# EAGLE design SwitchingUnit (EAGLE 9.3.1)
CNAME: YISC Entry - Device Unit; CREVISION: Prototype; DESIGNER: Matthew Charlston
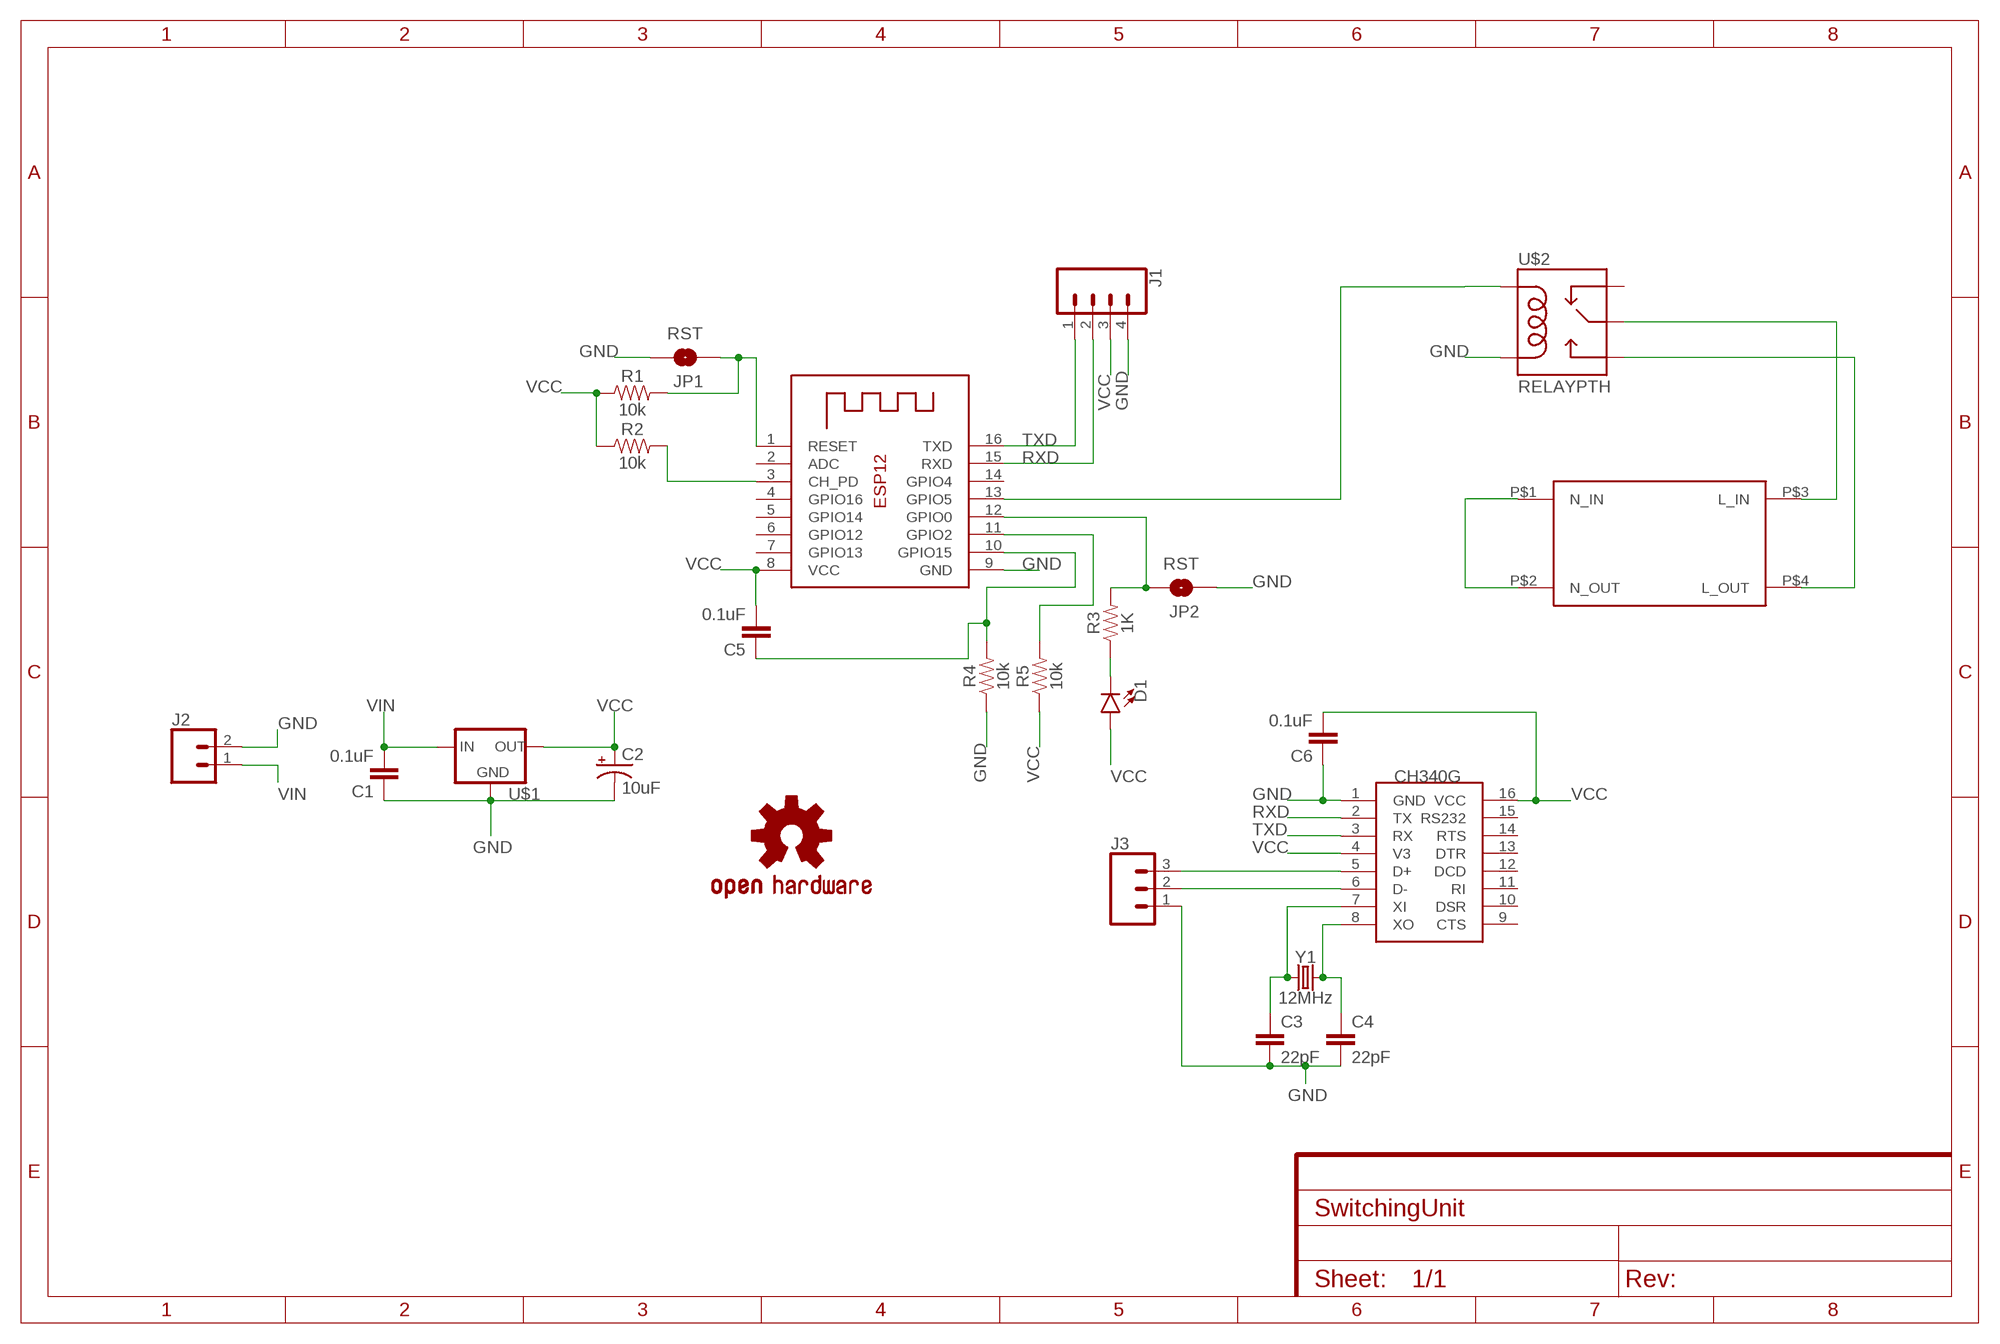
[diagram p0: schematic, sheet 1]

## Parts
C1  0.1uF  0.1UF-KIT-EZ-50V-20%  [CAP-PTH-SMALL-KIT]
C2  10uF  10UF-POLAR-RADIAL-2.5MM-25V-20%  [CPOL-RADIAL-2.5MM-5MM]
C3  22pF  22PF-PTH-2.54MM-200V-5%  [CAP-PTH-2.54]
C4  22pF  22PF-PTH-2.54MM-200V-5%  [CAP-PTH-2.54]
C5  0.1uF  0.1UF-KIT-EZ-50V-20%  [CAP-PTH-SMALL-KIT]
C6  0.1uF  0.1UF-KIT-EZ-50V-20%  [CAP-PTH-SMALL-KIT]
D1  LED5MM  [LED_5MM]
J1  CONN_04  [1X04]
J2  CONN_02  [1X02]
J3  CONN_03  [1X03]
JP1  RST  JUMPER-SMT_2_NO_SILK_ROUND  [SMT-JUMPER_2_NO_SILK_ROUND]
JP2  RST  JUMPER-SMT_2_NO_SILK_ROUND  [SMT-JUMPER_2_NO_SILK_ROUND]
LOGO1  OSHW-LOGOL  [OSHW-LOGO-L]
R1  10k  10KOHM-HORIZ-1/4W-1%  [AXIAL-0.3]
R2  10k  10KOHM-HORIZ-1/4W-1%  [AXIAL-0.3]
R3  1K  10KOHM-HORIZ-1/4W-1%  [AXIAL-0.3]
R4  10k  10KOHM-HORIZ-1/4W-1%  [AXIAL-0.3]
R5  10k  10KOHM-HORIZ-1/4W-1%  [AXIAL-0.3]
U$1  V_REG_LD1117VXX  [78XXL]
U$2  RELAYPTH  [SRD-05VDC-SL-C]
U$3  MC_MAINS  [MC_MAINS_NEW]
U$4  CH340G  [SOIC16]
X1  ESP-12  [ESP-12]
Y1  12MHz  CRYSTAL-16MHZPTH-HC49US  [HC49US]

## Nets
GND: C1.1 C2.2(-) C3.2 C4.2 C6.1 J1.4 J2.2 J3.1 JP1.2 JP2.1 R4.P$1 U$1.IN(GND) U$2.COIL0 U$4.1(GND) X1.9(GND)
N$1: C3.1 U$4.7(XI) Y1.1
N$2: C4.1 U$4.8(XO) Y1.2
N$3: JP1.1 R1.P$2 X1.1(RESET)
N$4: R2.P$2 X1.3(CH_PD)
N$5: JP2.2 R3.P$2 X1.12(GPIO0)
N$6: D1.K(C) R3.P$1
N$7: C5.1 R4.P$2 X1.10(GPIO15)
N$8: R5.P$2 X1.11(GPIO2)
N$9: U$3.P$1(N_IN) U$3.P$2(N_OUT)
N$10: U$2.COIL1 X1.13(GPIO5)
N$11: U$2.SWCOMMON U$3.P$3(L_IN)
N$12: U$2.SWOPEN U$3.P$4(L_OUT)
N$13: J3.3 U$4.5(D+)
N$14: J3.2 U$4.6(D-)
RXD: J1.2 U$4.2(TX) X1.15(RXD)
TXD: J1.1 U$4.3(RX) X1.16(TXD)
VCC: C2.1(+) C5.2 C6.2 D1.A J1.3 R1.P$1 R2.P$1 R5.P$1 U$1.GND(OUT) U$4.4(V3) U$4.16(VCC) X1.8(VCC)
VIN: C1.2 J2.1 U$1.OUT(IN)
Unconnected: U$2.SWCLOSED(SWCLOSE) U$4.9(CTS) U$4.10(DSR) U$4.11(RI) U$4.12(DCD) U$4.13(DTR) U$4.14(RTS) U$4.15(RS232) X1.2(ADC) X1.4(GPIO16) X1.5(GPIO14) X1.6(GPIO12) X1.7(GPIO13) X1.14(GPIO4)

## Library data of the parts
C1 C5 C6 = SparkFun-Capacitors:0.1UF: 0.1µF ceramic capacitors A capacitor is a passive two-terminal electrical component used to store electrical energy temporarily in an electric field.; PROD_ID: CAP-08370
C2 = SparkFun-Capacitors:10UF-POLAR: 10.0µF polarized capacitors A capacitor is a passive two-terminal electrical component used to store electrical energy temporarily in an electric field.; PROD_ID: CAP-08440
C3 C4 = SparkFun-Capacitors:22PF: 22pF ceramic capacitors A capacitor is a passive two-terminal electrical component used to store electrical energy temporarily in an electric field.; PROD_ID: CAP-09128
D1 = SparkFun-LED:LED: LED (Generic) Standard schematic elements and footprints for 5mm, 3mm, 1206, and 0603 sized LEDs. Generic LEDs with no color specified.
J1 = SparkFun-Connectors:CONN_04: Multi connection point. Often used as Generic Header-pin footprint for 0.1 inch spaced/style header connections On any of the 0.1 inch spaced packages, you can populate with these: Break Away Headers - Straight <https://www.sparkfun.com/products/116> (PRT-00116) Break Away Male Headers - Right Angle <https://www.sparkfun.com/products/553> (PRT-00553) Female Headers <https://www.sparkfun.com/products/115> (PRT-00115) Break Away Headers - Machine Pin <https://www.sparkfun.com/products/117> (PRT-00117) Break Away Female Headers - Swiss Machine Pin <https://www.sparkfun.com/products/743> (PRT-00743) For SCREWTERMINALS and SPRING TERMINALS visit here: Screw Terimnals on SparkFun.com <https://www.sparkfun.com/search/results?term=Screw+Terminals> (5mm/3.5mm/2.54mm spacing) This device is also useful as a general connection point to wire up your design to another part of your project. Our various solder wires solder well into these plated through hole pads. Hook-Up Wire - Assortment (Stranded, 22 AWG) <https://www.sparkfun.com/products/11375> (PRT-11375) Hook-Up Wire - Assortment (Solid Core, 22 AWG) <https://www.sparkfun.com/products/11367> (PRT-11367) View the entire wire category on our website here <https://www.sparkfun.com/categories/141> Special notes: Molex polarized connector foot print use with SKU : PRT-08231 with associated crimp pins and housings. 1MM SMD Version SKU: PRT-10208; PROD_ID: CONN-09696
J2 = SparkFun-Connectors:CONN_02: Multi connection point. Often used as Generic Header-pin footprint for 0.1 inch spaced/style header connections On any of the 0.1 inch spaced packages, you can populate with these: Break Away Headers - Straight <https://www.sparkfun.com/products/116> (PRT-00116) Break Away Male Headers - Right Angle <https://www.sparkfun.com/products/553> (PRT-00553) Female Headers <https://www.sparkfun.com/products/115> (PRT-00115) Break Away Headers - Machine Pin <https://www.sparkfun.com/products/117> (PRT-00117) Break Away Female Headers - Swiss Machine Pin <https://www.sparkfun.com/products/743> (PRT-00743) For SCREWTERMINALS and SPRING TERMINALS visit here: Screw Terimnals on SparkFun.com <https://www.sparkfun.com/search/results?term=Screw+Terminals> (5mm/3.5mm/2.54mm spacing) This device is also useful as a general connection point to wire up your design to another part of your project. Our various solder wires solder well into these plated through hole pads. Hook-Up Wire - Assortment (Stranded, 22 AWG) <https://www.sparkfun.com/products/11375> (PRT-11375) Hook-Up Wire - Assortment (Solid Core, 22 AWG) <https://www.sparkfun.com/products/11367> (PRT-11367) View the entire wire category on our website here <https://www.sparkfun.com/categories/141> Special notes: Molex polarized connector foot print use with: PRT-08233 with associated crimp pins and housings. 2.54_SCREWTERM for use with PRT-10571. 3.5mm Screw Terminal footprints for PRT-08084 5mm Screw Terminal footprints for use with PRT-08432
J3 = SparkFun-Connectors:CONN_03: Multi connection point. Often used as Generic Header-pin footprint for 0.1 inch spaced/style header connections On any of the 0.1 inch spaced packages, you can populate with these: Break Away Headers - Straight <https://www.sparkfun.com/products/116> (PRT-00116) Break Away Male Headers - Right Angle <https://www.sparkfun.com/products/553> (PRT-00553) Female Headers <https://www.sparkfun.com/products/115> (PRT-00115) Break Away Headers - Machine Pin <https://www.sparkfun.com/products/117> (PRT-00117) Break Away Female Headers - Swiss Machine Pin <https://www.sparkfun.com/products/743> (PRT-00743) Stackable Header - 3 Pin (Female, 0.1") <https://www.sparkfun.com/products/13875> (PRT-13875) For SCREWTERMINALS and SPRING TERMINALS visit here: Screw Terimnals on SparkFun.com <https://www.sparkfun.com/search/results?term=Screw+Terminals> (5mm/3.5mm/2.54mm spacing) This device is also useful as a general connection point to wire up your design to another part of your project. Our various solder wires solder well into these plated through hole pads. Hook-Up Wire - Assortment (Stranded, 22 AWG) <https://www.sparkfun.com/products/11375> (PRT-11375) Hook-Up Wire - Assortment (Solid Core, 22 AWG) <https://www.sparkfun.com/products/11367> (PRT-11367) View the entire wire category on our website here <https://www.sparkfun.com/categories/141> Special notes: Molex polarized connector foot print use with SKU : PRT-08232 with associated crimp pins and housings.
JP1 JP2 = SparkFun-Jumpers:JUMPER-SMT_2_NO: Normally open jumper This jumper has two pads in close proximity to each other. Apply solder to close the connection. Round pads are easier to solder for beginners, but are a lot larger. SparkFun Product that uses the round pads: SparkFun EL Sequencer <https://www.sparkfun.com/products/12781>
LOGO1 = SparkFun-Aesthetics:OSHW-LOGO: Open-Source Hardware (OSHW) Logo This logo indicates the piece of hardware it is found on incorporates a OSHW license and/or adheres to the definition of open source hardware found here: http://freedomdefined.org/OSHW
R1 R2 R4 R5 = SparkFun-Resistors:10KOHM: 10kΩ resistor A resistor is a passive two-terminal electrical component that implements electrical resistance as a circuit element. Resistors act to reduce current flow, and, at the same time, act to lower voltage levels within circuits. - Wikipedia; PROD_ID: RES-12183
R3 = SparkFun-Resistors:10KOHM: 10kΩ resistor A resistor is a passive two-terminal electrical component that implements electrical resistance as a circuit element. Resistors act to reduce current flow, and, at the same time, act to lower voltage levels within circuits. - Wikipedia; PROD_ID: RES-12183; VALUE: 10k
U$1 = SparkFun-IC-Power:V_REG_LD1117VXX: LD1117VXX voltage regulator. We carry the 3.3V version (COM-00526) in TO-220 package.
U$2 = SRD-05VDC-SL-C:RELAY: SPDT relay (COM-00101)
U$3 = untitled:MC_MAINS
U$4 = ch340g:CH340G
X1 = adafruit:ESP-12
Y1 = SparkFun-Clocks:CRYSTAL-16MHZ: 16MHz Crystal Digikey Example <http://www.digikey.com/product-search/en?keywords=535-9122-1-ND> Frequency: 16MHz Frequency Stability: ±50ppm Frequency Tolerance: ±20ppm Load Capacitance: 18pF SparkFun Products: Pro Micro -5V/16MHz <https://www.sparkfun.com/products/12640> SparkFun Serial Enabled LCD Kit <https://www.sparkfun.com/products/10097>; PROD_ID: XTAL-08181; SF_ID: COM-00536; VALUE: 16MHz

## Board
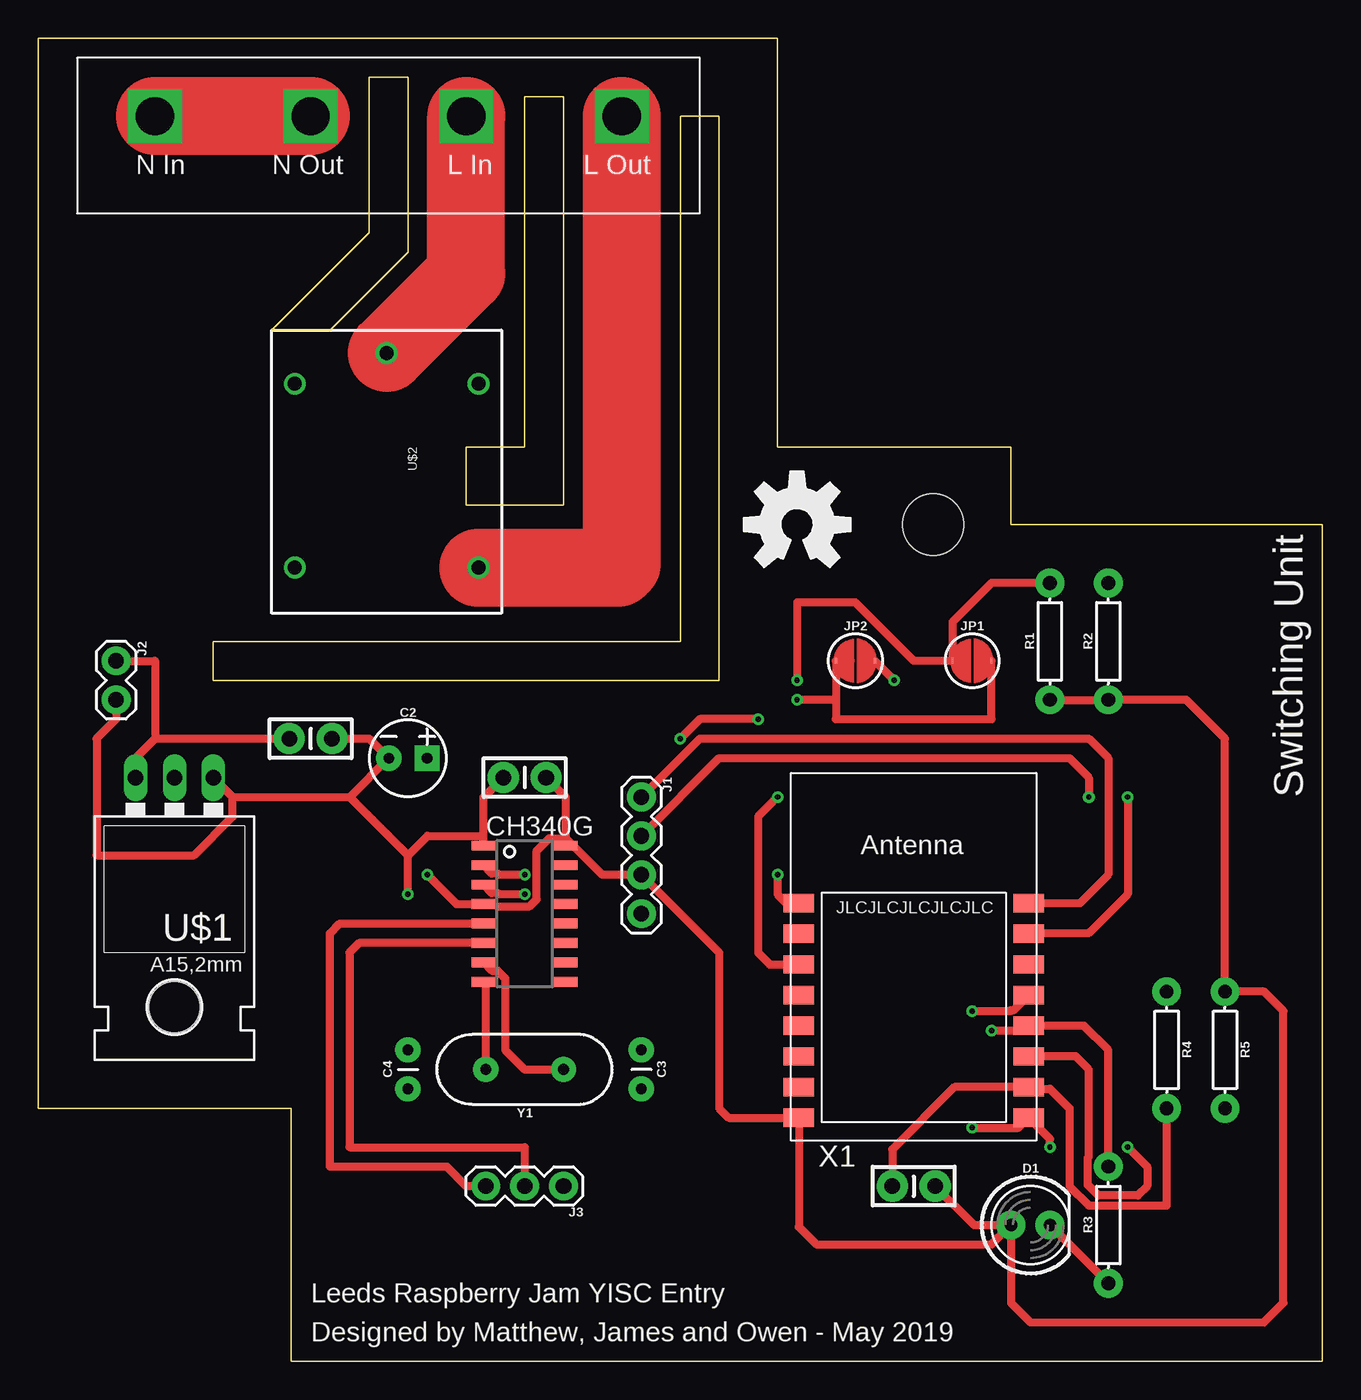
[diagram p1: board, top side]
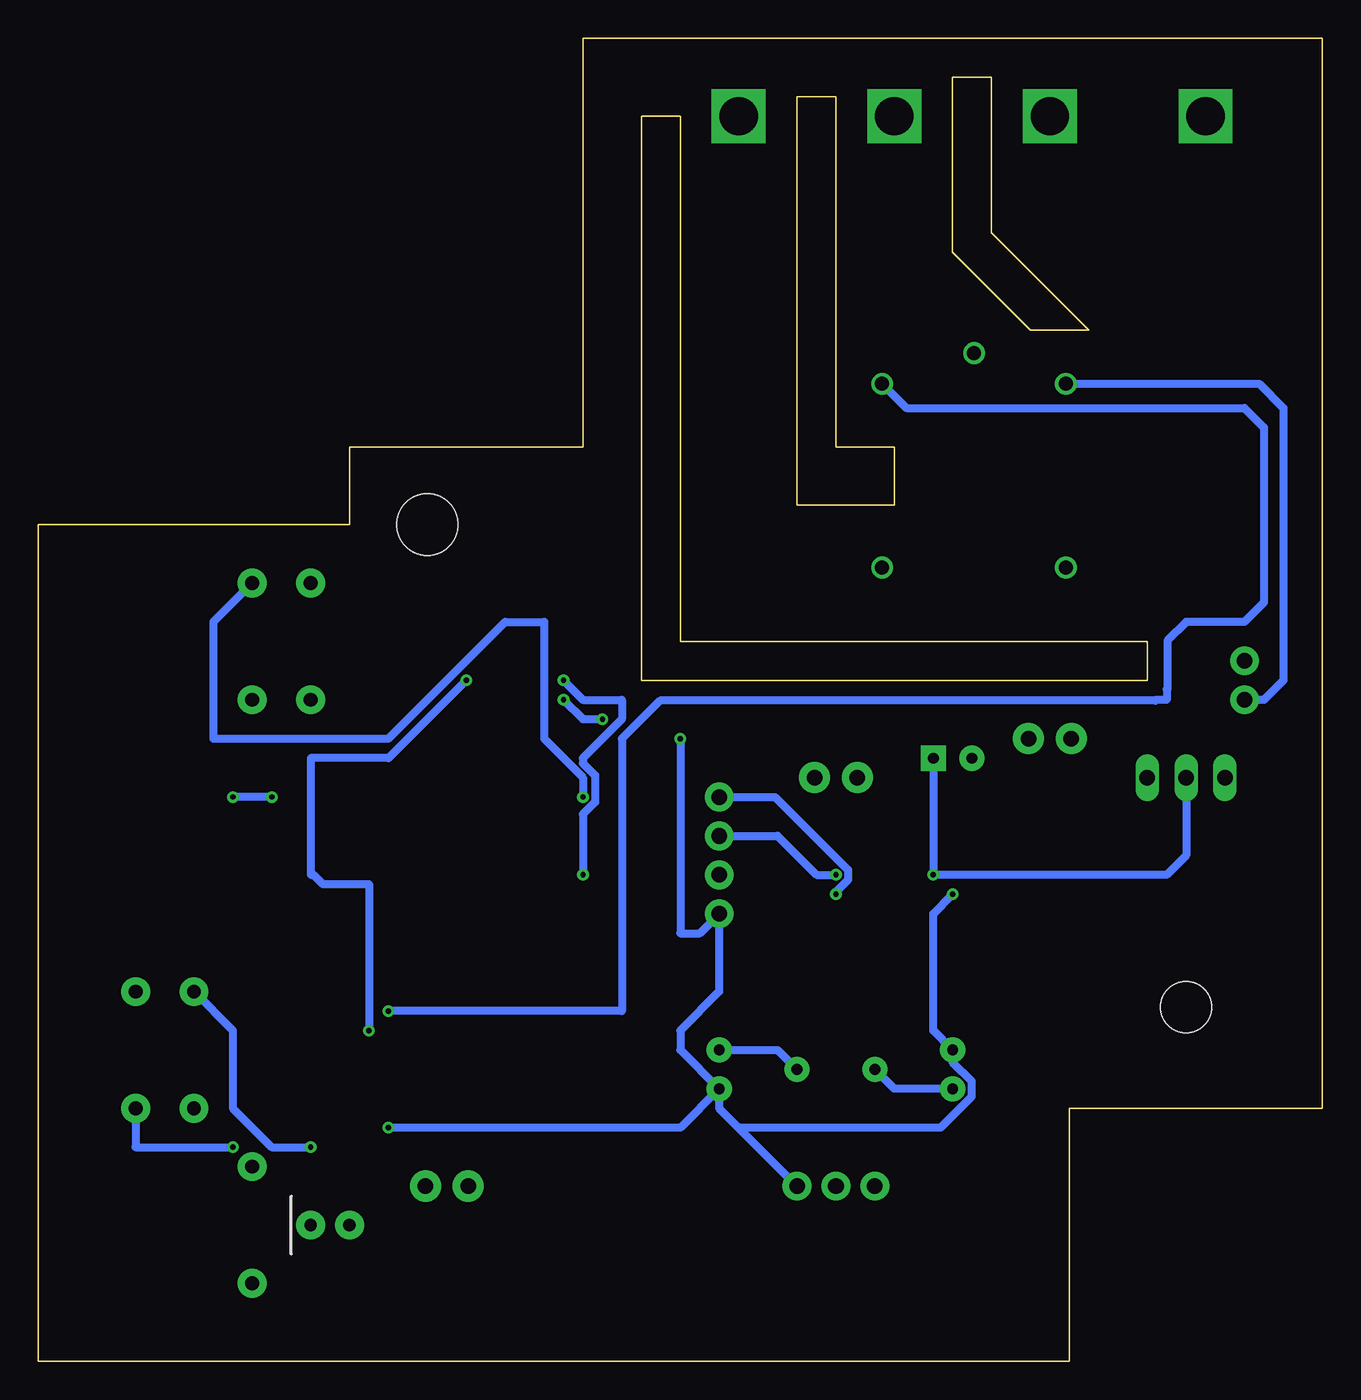
[diagram p2: board, bottom side, seen from below]

Size 83.82 x 86.36 mm. Coordinates in mm from the lower left corner, seen from the top.
Outline: 31.75,82.55 34.29,82.55 34.29,55.88 27.94,55.88 27.94,59.69 31.75,59.69 31.75,82.55
Outline: 41.91,81.28 41.91,46.99 11.43,46.99 11.43,44.45 44.45,44.45 44.45,81.28 41.91,81.28
Outline: 24.13,83.82 24.13,72.39 19.05,67.31 15.24,67.31 21.59,73.66 21.59,83.82 24.13,83.82
Outline: 0,16.51 16.51,16.51 16.51,0 83.82,0 83.82,54.61 63.5,54.61 63.5,59.69 48.26,59.69 48.26,86.36 0,86.36 0,16.51
Copper layers (1*16): Top 0.035mm / dielectric 1.5mm / Bottom 0.035mm
Design rules "default": minimum track width 6mil, minimum drill 0.35mm, track to track 6mil, track to pad 6mil, pad to pad 6mil, via to via 6mil, smd to smd 6mil, copper to edge 40mil, drill to drill 6mil, minimum pad ring 10mil, minimum via ring 8mil, stop-mask expansion 4mil, vias tented up to drill 0mil, thermal gap 10mil
Holes 4 mm at 58.42,54.61

### Footprints (pad centres in the part's own frame; a part is rotated, then mirrored left to right if it is on the bottom)
CAP-PTH-SMALL-KIT = drill 1.016 pad 2.032: 1 -1.397,0; 2 1.397,0
CPOL-RADIAL-2.5MM-5MM = drill 0.7 pad 1.651 square: 1 1.25,0 | drill 0.7 pad 1.651: 2 -1.25,0
CAP-PTH-2.54 = drill 0.7 pad 1.651: 1 -1.27,0; 2 1.27,0
LED_5MM = drill 0.813 pad 1.88: A -1.27,0; K 1.27,0
1X04 = drill 1.016 pad 1.88: 1 0,0; 2 2.54,0; 3 5.08,0; 4 7.62,0
1X02 = drill 1.016 pad 1.88: 1 0,0; 2 2.54,0
1X03 = drill 1.016 pad 1.88: 1 0,0; 2 2.54,0; 3 5.08,0
SMT-JUMPER_2_NO_SILK_ROUND = smd 0.152 x 0.305: 1 -1.27,0; 2 1.27,0
AXIAL-0.3 = drill 0.9 pad 1.88: P$1 -3.81,0; P$2 3.81,0
78XXL = drill 1.016 long: GND 0,-3.81; IN -2.54,-3.81; OUT 2.54,-3.81 | hole 3.302: 0,11.176
SRD-05VDC-SL-C = drill 0.9: COIL0 -5.39,-6.12; COIL1 -5.39,5.88; SWCLOSED 6.61,-6.12; SWCOMMON -7.39,-0.12; SWOPEN 6.61,5.88
MC_MAINS_NEW = drill 2.5 square: P$1 -31.75,1.27; P$2 -21.59,1.27; P$3 -11.43,1.27; P$4 -1.27,1.27
SOIC16 = smd 0.635 x 1.524: 1 -4.445,-2.695; 2 -3.175,-2.695; 3 -1.905,-2.695; 4 -0.635,-2.695; 5 0.635,-2.695; 6 1.905,-2.695; 7 3.175,-2.695; 8 4.445,-2.695; 9 4.445,2.695; 10 3.175,2.695; 11 1.905,2.695; 12 0.635,2.695; 13 -0.635,2.695; 14 -1.905,2.695; 15 -3.175,2.695; 16 -4.445,2.695
ESP-12 = smd 2 x 1.2: 1 -7.5,4.5; 2 -7.5,2.5; 3 -7.5,0.5; 4 -7.5,-1.5; 5 -7.5,-3.5; 6 -7.5,-5.5; 7 -7.5,-7.5; 8 -7.5,-9.5; 9 7.5,-9.5; 10 7.5,-7.5; 11 7.5,-5.5; 12 7.5,-3.5; 13 7.5,-1.5; 14 7.5,0.5; 15 7.5,2.5; 16 7.5,4.5
HC49US = drill 0.7 pad 1.651: 1 -2.54,0; 2 2.54,0

### Placement (x,y rotation side)
C1  17.78,40.64 180 top
C2  24.13,39.37 0 top
C3  39.37,19.05 270 top
C4  24.13,19.05 90 top
C5  57.15,11.43 0 top
C6  31.75,38.1 0 top
D1  64.77,8.89 0 top
J1  39.37,36.83 270 top
J2  5.08,45.72 270 top
J3  34.29,11.43 180 top
JP1  60.96,45.72 0 top
JP2  53.34,45.72 0 top
LOGO1  49.53,54.61 0 top
R1  66.04,46.99 90 top
R2  69.85,46.99 90 top
R3  69.85,8.89 90 top
R4  73.66,20.32 270 top
R5  77.47,20.32 270 top
U$1  8.89,34.29 180 top
U$2  22.86,58.42 270 top
U$3  39.37,80.01 0 top
U$4  31.75,29.21 270 top
X1  57.15,25.4 0 top
Y1  31.75,19.05 180 top

### Tracks (layer width: path | path; a pad name or v marks a point on that pad's centre or on a via)
GND  (via drill 0.35)
  Top 0.508: U$4.1 29.05,34.29 | 29.05,34.29 29.05,36.8 C6.1 | v24.13,30.48 24.13,33.02 | 24.13,33.02 25.4,34.29 29.05,34.29 | U$1.IN 12.7,36.83 | 20.32,36.83 24.13,33.02 | 12.7,36.83 20.32,36.83 | J2.2 5.08,41.91 3.81,40.64 3.81,33.02 10.16,33.02 12.7,35.56 12.7,36.83 | C1.1 21.61,40.64 C2.2 20.34,36.83 20.32,36.83 | 53.04,45.72 JP2.1 52.07,43.18 | v60.96,15.24 63.99,15.24 X1.9 66.04,14.51 v66.04,13.97 | 52.07,43.18 52.07,41.91 62.23,41.91 JP1.2 | 52.07,43.18 v49.53,43.18 | v46.99,41.91 43.18,41.91 v41.91,40.64
  Bottom 0.508: C3.2 39.37,16.51 38.1,15.24 | 38.1,15.24 J3.1 | 38.1,15.24 24.93,15.24 22.9,17.27 22.9,18.29 24.13,19.52 C4.2 25.4,21.59 25.4,29.21 v24.13,30.48 | C3.2 41.91,20.32 41.91,21.59 39.37,24.13 J1.4 40.64,27.94 41.91,27.94 v41.91,40.64 | C3.2 41.91,15.24 v60.96,15.24 | R4.P$1 71.12,21.59 71.12,16.51 68.58,13.97 v66.04,13.97 | v49.53,43.18 48.26,41.91 v46.99,41.91 | U$2.COIL0 4.12,63.81 2.54,62.23 2.54,44.45 3.81,43.18 J2.2
N$1
  Top 0.508: U$4.7 29.6,25.49 29.98,25.49 30.48,24.99 30.48,20.32 31.75,19.05 Y1.1
  Bottom 0.508: C3.1 35.56,20.32 Y1.1
N$2
  Top 0.508: U$4.8 29.21,24.61 Y1.2
  Bottom 0.508: C4.1 27.94,17.78 Y1.2
N$3  (via drill 0.35)
  Top 0.508: R1.P$2 62.23,50.8 59.69,48.26 JP1.1 57.15,45.72 53.34,49.53 49.53,49.53 v49.53,44.45 | v48.26,31.75 48.26,30.48 48.84,29.9 X1.1
  Bottom 0.508: v49.53,44.45 48.26,43.18 45.72,43.18 45.72,41.91 48.26,39.37 48.26,39.03 47.48,38.25 47.48,36.51 48.26,35.72 v48.26,31.75
N$4  (via drill 0.35)
  Top 0.508: v48.26,36.83 46.99,35.56 46.99,26.67 47.76,25.9 X1.3
  Bottom 0.508: R2.P$2 72.39,48.26 72.39,40.64 60.96,40.64 53.34,48.26 50.8,48.26 50.8,40.64 48.26,38.1 v48.26,36.83
N$5  (via drill 0.35)
  Top 0.508: R3.P$2 69.85,20.32 68.27,21.9 64.77,21.9 | 64.77,21.9 X1.12 | JP2.2 v55.88,44.45 | v62.23,21.59 64.46,21.59 64.77,21.9
  Bottom 0.508: v55.88,44.45 60.96,39.37 66.04,39.37 66.04,31.75 65.86,31.75 65.25,31.15 62.23,31.15 v62.23,21.59
N$6
  Top 0.508: D1.K R3.P$1
N$7
  Top 0.508: C5.1 55.75,13.84 59.81,17.9 X1.10 64.77,17.78 66.04,17.78 67.31,16.51 67.31,11.43 68.58,10.16 73.66,10.16 R4.P$2
N$8  (via drill 0.35)
  Top 0.508: v71.12,13.97 72.39,12.7 72.39,11.43 71.78,10.82 69.19,10.82 68.5,11.51 68.5,13.26 68.58,13.33 68.58,19.05 67.73,19.9 X1.11
  Bottom 0.508: R5.P$2 77.47,13.97 v71.12,13.97
N$9
  Top 5.08: U$3.P$2 U$3.P$1
N$10  (via drill 0.35)
  Top 0.508: v60.96,22.86 63.44,22.86 63.48,22.91 63.66,22.91 X1.13
  Bottom 0.508: U$2.COIL1 27.16,62.23 5.08,62.23 3.81,60.96 3.81,49.53 5.08,48.26 8.89,48.26 10.11,47.04 10.11,43.9 10.16,43.85 10.16,43.18 10.83,43.18 10.88,43.13 43.23,43.13 45.72,40.64 45.72,22.86 v60.96,22.86
N$11
  Top 5.08: U$2.SWCOMMON 27.94,71.01 U$3.P$3
N$12
  Top 5.08: U$2.SWOPEN 37.84,51.81 38.1,52.07 U$3.P$4
N$13
  Top 0.508: J3.3 27.94,11.43 26.67,12.7 19.05,12.7 19.05,27.94 19.68,28.58 U$4.5
N$14
  Top 0.508: J3.2 31.75,13.97 20.32,13.97 20.32,26.67 20.95,27.3 U$4.6
RXD  (via drill 0.35)
  Top 0.508: v31.75,31.75 30.07,31.75 29.98,31.84 29.6,31.84 U$4.2 | J1.2 44.45,39.37 67.31,39.37 68.58,38.1 v68.58,36.83 | v71.12,36.83 71.12,30.48 68.58,27.94 64.69,27.94 X1.15
  Bottom 0.508: J1.2 35.56,34.29 33.02,31.75 v31.75,31.75 | v68.58,36.83 v71.12,36.83
TXD  (via drill 0.35)
  Top 0.508: v31.75,30.48 30.07,30.48 29.98,30.57 29.6,30.57 U$4.3 | J1.1 43.18,40.64 68.58,40.64 69.85,39.37 69.85,31.75 68,29.9 X1.16
  Bottom 0.508: v31.75,30.48 31.75,30.64 30.96,31.43 30.96,32.08 35.72,36.83 J1.1
VCC  (via drill 0.35)
  Top 0.508: U$4.16 34.45,34.13 | 34.45,34.13 34.45,36.8 C6.2 | v25.4,31.75 27.3,29.84 U$4.4 29.77,29.84 29.93,29.7 32.08,29.7 32.54,30.16 32.54,33.33 33.35,34.13 34.45,34.13 | 34.45,34.13 36.83,31.75 J1.3 44.45,26.67 44.45,16.51 45.06,15.9 X1.8 49.65,8.77 50.8,7.62 62.23,7.62 D1.A | R1.P$1 R2.P$1 74.93,43.18 77.47,40.64 R5.P$1 80.01,24.13 81.28,22.86 81.28,3.81 80.01,2.54 64.77,2.54 63.5,3.81 D1.A | C5.2 61.09,8.89 D1.A
  Bottom 0.508: U$1.GND 8.89,33.02 10.16,31.75 v25.4,31.75 25.4,39.35 C2.1
VIN
  Top 0.508: J2.1 7.62,45.72 7.62,40.64 | 7.62,40.64 6.35,39.37 U$1.OUT | 7.62,40.64 C1.2

### Text on the board
tNames: Switching Unit | JLCJLCJLCJLCJLC | Leeds Raspberry Jam YISC Entry | Designed by Matthew, James and Owen - May 2019